# EAGLE design usb-100basefx (EAGLE 6.4)
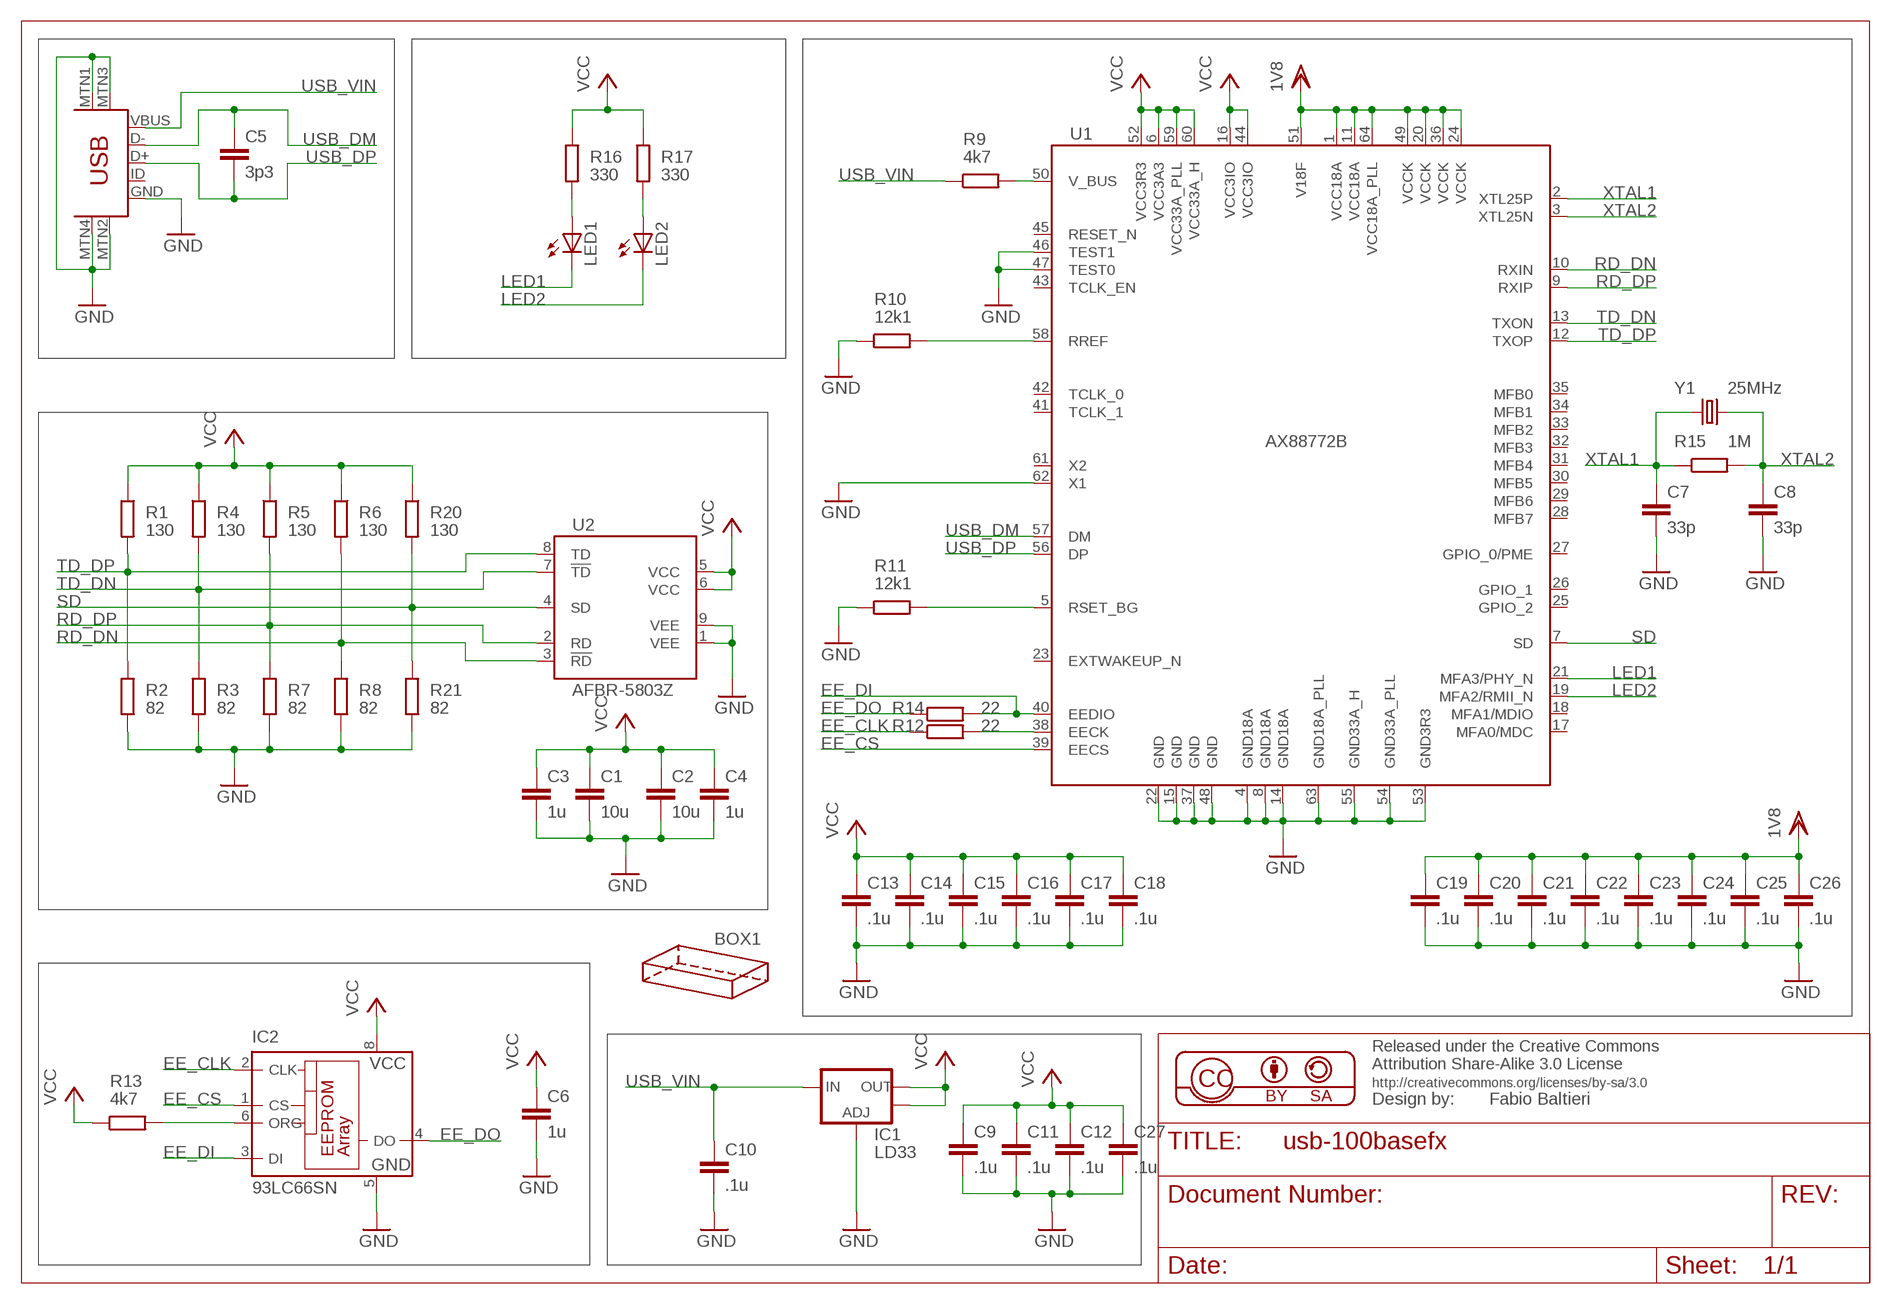
[diagram p0: schematic, sheet 1]

## Parts
BOX1  HAMMOND-BOX-R  [1551R]
C1  10u  C-EUC0603  [C0603]
C2  10u  C-EUC0603  [C0603]
C3  1u  C-EUC0603  [C0603]
C4  1u  C-EUC0603  [C0603]
C5  3p3  C-EUC0603  [C0603]
C6  1u  C-EUC0603  [C0603]
C7  33p  C-EUC0603  [C0603]
C8  33p  C-EUC0603  [C0603]
C9  .1u  C-EUC0603  [C0603]
C10  .1u  C-EUC0603  [C0603]
C11  .1u  C-EUC0603  [C0603]
C12  .1u  C-EUC0603  [C0603]
C13  .1u  C-EUC0603  [C0603]
C14  .1u  C-EUC0603  [C0603]
C15  .1u  C-EUC0603  [C0603]
C16  .1u  C-EUC0603  [C0603]
C17  .1u  C-EUC0603  [C0603]
C18  .1u  C-EUC0603  [C0603]
C19  .1u  C-EUC0603  [C0603]
C20  .1u  C-EUC0603  [C0603]
C21  .1u  C-EUC0603  [C0603]
C22  .1u  C-EUC0603  [C0603]
C23  .1u  C-EUC0603  [C0603]
C24  .1u  C-EUC0603  [C0603]
C25  .1u  C-EUC0603  [C0603]
C26  .1u  C-EUC0603  [C0603]
C27  .1u  C-EUC0603  [C0603]
IC1  LD33  V_REG_LM1117SOT223  [SOT223]
IC2  93LC66SN  [SO-08]
LED1  LEDCHIPLED_0805  [CHIPLED_0805]
LED2  LEDCHIPLED_0805  [CHIPLED_0805]
R1  130  R-EU_R0603  [R0603]
R2  82  R-EU_R0603  [R0603]
R3  82  R-EU_R0603  [R0603]
R4  130  R-EU_R0603  [R0603]
R5  130  R-EU_R0603  [R0603]
R6  130  R-EU_R0603  [R0603]
R7  82  R-EU_R0603  [R0603]
R8  82  R-EU_R0603  [R0603]
R9  4k7  R-EU_R0603  [R0603]
R10  12k1  R-EU_R0603  [R0603]
R11  12k1  R-EU_R0603  [R0603]
R12  22  R-EU_R0603  [R0603]
R13  4k7  R-EU_R0603  [R0603]
R14  22  R-EU_R0603  [R0603]
R15  1M  R-EU_R0603  [R0603]
R16  330  R-EU_R0603  [R0603]
R17  330  R-EU_R0603  [R0603]
R20  130  R-EU_R0603  [R0603]
R21  82  R-EU_R0603  [R0603]
U1  AX88772B  [LQFP64-0.4MM]
U2  AFBR-5803Z  [AFBR-5803Z]
U$1  USB-MINIB-5PIN  [USB-MINIB]
Y1  25MHz  CRYSTAL5X3  [CRYSTAL-SMD-5X3]

## Nets
EE_CLK: IC2.2(CLK) R12.1
EE_CS: IC2.1(CS) U1.39(EECS)
EE_DI: IC2.3(DI) R14.2 U1.40(EEDIO)
EE_DO: IC2.4(DO) R14.1
GND: C1.2 C2.2 C3.2 C4.2 C6.2 C7.2 C8.2 C9.2 C10.2 C11.2 C12.2 C13.2 C14.2 C15.2 C16.2 C17.2 C18.2 C19.2 C20.2 C21.2 C22.2 C23.2 C24.2 C25.2 C26.2 C27.2 IC1.1(ADJ) IC2.5(GND) R2.2 R3.2 R7.2 R8.2 R10.1 R11.1 R21.2 U1.4(GND18A) U1.8(GND18A) U1.14(GND18A) U1.15(GND) U1.22(GND) U1.37(GND) U1.46(TEST1) U1.47(TEST0) U1.48(GND) U1.53(GND3R3) U1.54(GND33A_PLL) U1.55(GND33A_H) U1.62(X1) U1.63(GND18A_PLL) U2.1(VEE) U2.9(VEE) U$1.GND U$1.MTN1(MTN2) U$1.MTN2(MTN3) U$1.MTN3(MTN1) U$1.MTN4
LED1: LED1.C U1.21(MFA3/PHY_N)
LED2: LED2.C U1.19(MFA2/RMII_N)
N$1: R9.2 U1.50(V_BUS)
N$2: R10.2 U1.58(RREF)
N$3: R11.2 U1.5(RSET_BG)
N$4: R12.2 U1.38(EECK)
N$5: IC2.6(ORG) R13.2
N$6: LED1.A R16.2
N$7: LED2.A R17.2
RD_DN: R6.2 R8.1 U1.10(RXIN) U2.3(!RD)
RD_DP: R5.2 R7.1 U1.9(RXIP) U2.2(RD)
SD: R20.2 R21.1 U1.7(SD) U2.4(SD)
TD_DN: R3.1 R4.2 U1.13(TXON) U2.7(!TD)
TD_DP: R1.2 R2.1 U1.12(TXOP) U2.8(TD)
USB_DM: C5.1 U1.57(DM) U$1.D-
USB_DP: C5.2 U1.56(DP) U$1.D+
USB_VIN: C10.1 IC1.3(IN) R9.1 U$1.VBUS
VCC: C1.1 C2.1 C3.1 C4.1 C6.1 C9.1 C11.1 C12.1 C13.1 C14.1 C15.1 C16.1 C17.1 C18.1 C27.1 IC1.2(OUT) IC1.4(OUT) IC2.8(VCC) R1.1 R4.1 R5.1 R6.1 R13.1 R16.1 R17.1 R20.1 U1.6(VCC3A3) U1.16(VCC3IO) U1.44(VCC3IO) U1.52(VCC3R3) U1.59(VCC33A_PLL) U1.60(VCC33A_H) U2.5(VCC) U2.6(VCC)
VDD: C19.1 C20.1 C21.1 C22.1 C23.1 C24.1 C25.1 C26.1 U1.1(VCC18A) U1.11(VCC18A) U1.20(VCCK) U1.24(VCCK) U1.36(VCCK) U1.49(VCCK) U1.51(V18F) U1.64(VCC18A_PLL) ; supply symbol labelled 1V8
XTAL1: C7.1 R15.1 U1.2(XTL25P) Y1.1
XTAL2: C8.1 R15.2 U1.3(XTL25N) Y1.3
Unconnected: IC2.7(NU) U1.17(MFA0/MDC) U1.18(MFA1/MDIO) U1.23(EXTWAKEUP_N) U1.25(GPIO_2) U1.26(GPIO_1) U1.27(GPIO_0/PME) U1.28(MFB7) U1.29(MFB6) U1.30(MFB5) U1.31(MFB4) U1.32(MFB3) U1.33(MFB2) U1.34(MFB1) U1.35(MFB0) U1.41(TCLK_1) U1.42(TCLK_0) U1.43(TCLK_EN) U1.45(RESET_N) U1.61(X2) U$1.ID

## Library data of the parts
BOX1 = hammond:HAMMOND-BOX: Hammond Project boxes Hammond 1551 Transluscent Blue 50x35x20mm 1551GTBU http://www.hammondmfg.com/pdf/1551G.pdf Hammond 1551 Transluscent Blue 50x50x20mm 1551RTBU http://www.hammondmfg.com/pdf/1551R.pdf Hammond 1551 Transluscent Blue 60x35x20mm 1551HTBU http://www.hammondmfg.com/pdf/1551H.pdf Hammond 1551 Transluscent Blue 80x40x20mm 1551KTBU http://www.hammondmfg.com/pdf/1551K.pdf Hammond 1591 Transluscent Blue 100x51x22m m 1591XXATBU http://www.hammondmfg.com/pdf/1591XXA.pdf
C1-C27 = rcl:C-EU: CAPACITOR, European symbol
IC1 = SparkFun-PowerIC:V_REG_LM1117: Voltage Regulator LM1117 Standard adjustable voltage regulator but in SMD form. Spark Fun Electronics SKU : COM-00595
IC2 = microchip:93*: Serial EPROM 1 K/2 K/4 K, low voltage, Microwire; MF: MICROCHIP; MPN: 93LC66/SN; OC_FARNELL: 1296586; OC_NEWARK: 65K1154
LED1 LED2 = led:LED: LED OSRAM: - CHIPLED LG R971, LG N971, LY N971, LG Q971, LY Q971, LO R971, LY R971 LH N974, LH R974 LS Q976, LO Q976, LY Q976 LO Q996 - Hyper CHIPLED LW Q18S LB Q993, LB Q99A, LB R99A - SideLED LS A670, LO A670, LY A670, LG A670, LP A670 LB A673, LV A673, LT A673, LW A673 LH A674 LY A675 LS A676, LA A676, LO A676, LY A676, LW A676 LS A679, LY A679, LG A679 - Hyper Micro SIDELED® LS Y876, LA Y876, LO Y876, LY Y876 LT Y87S - SmartLED LW L88C, LW L88S LB L89C, LB L89S, LG L890 LS L89K, LO L89K, LY L89K LS L896, LA L896, LO L896, LY L896 - TOPLED LS T670, LO T670, LY T670, LG T670, LP T670 LSG T670, LSP T670, LSY T670, LOP T670, LYG T670 LG T671, LOG T671, LSG T671 LB T673, LV T673, LT T673, LW T673 LH T674 LS T676, LA T676, LO T676, LY T676, LB T676, LH T676, LSB T676, LW T676 LB T67C, LV T67C, LT T67C, LS T67K, LO T67K, LY T67K, LW E67C LS E67B, LA E67B, LO E67B, LY E67B, LB E67C, LV E67C, LT E67C LW T67C LS T679, LY T679, LG T679 LS T770, LO T770, LY T770, LG T770, LP T770 LB T773, LV T773, LT T773, LW T773 LH T774 LS E675, LA E675, LY E675, LS T675 LS T776, LA T776, LO T776, LY T776, LB T776 LHGB T686 LT T68C, LB T68C - Hyper Mini TOPLED® LB M676 - Mini TOPLED Santana® LG M470 LS M47K, LO M47K, LY M47K Source: http://www.osram.convergy.de LUXEON: - LUMILED® LXK2-PW12-R00, LXK2-PW12-S00, LXK2-PW14-U00, LXK2-PW14-V00 LXK2-PM12-R00, LXK2-PM12-S00, LXK2-PM14-U00 LXK2-PE12-Q00, LXK2-PE12-R00, LXK2-PE12-S00, LXK2-PE14-T00, LXK2-PE14-U00 LXK2-PB12-K00, LXK2-PB12-L00, LXK2-PB12-M00, LXK2-PB14-N00, LXK2-PB14-P00, LXK2-PB14-Q00 LXK2-PR12-L00, LXK2-PR12-M00, LXK2-PR14-Q00, LXK2-PR14-R00 LXK2-PD12-Q00, LXK2-PD12-R00, LXK2-PD12-S00 LXK2-PH12-R00, LXK2-PH12-S00 LXK2-PL12-P00, LXK2-PL12-Q00, LXK2-PL12-R00 Source: www.luxeon.com KINGBRIGHT: KA-3528ASYC Source: www.kingbright.com
R1-R17 R20 R21 = rcl:R-EU_: RESISTOR, European symbol
U1 = balto:AX88772B: AX88772BLF / AX88772BLI Low-power
U2 = balto:AFBR-5803Z: AFBR-5803Z
U$1 = SparkFun-Connectors:USB-MINIB: Mini-USB "B" connector with 5th pin broken out. Created new symbol breaking out 5th "ID" pin in mini/micro USB connector spec. See: http://en.wikipedia.org/wiki/Mini_usb#Cables. Uses same footprint as 4-pin symbol. Also added pins to connect to mounting / shield pads if required (probably not generally needed as signals aren't shielded once they leave the connector).
Y1 = SparkFun-FreqCtrl:CRYSTAL: Various standard crystals. Proven footprints. Spark Fun Electronics SKU : COM-00534

## Board
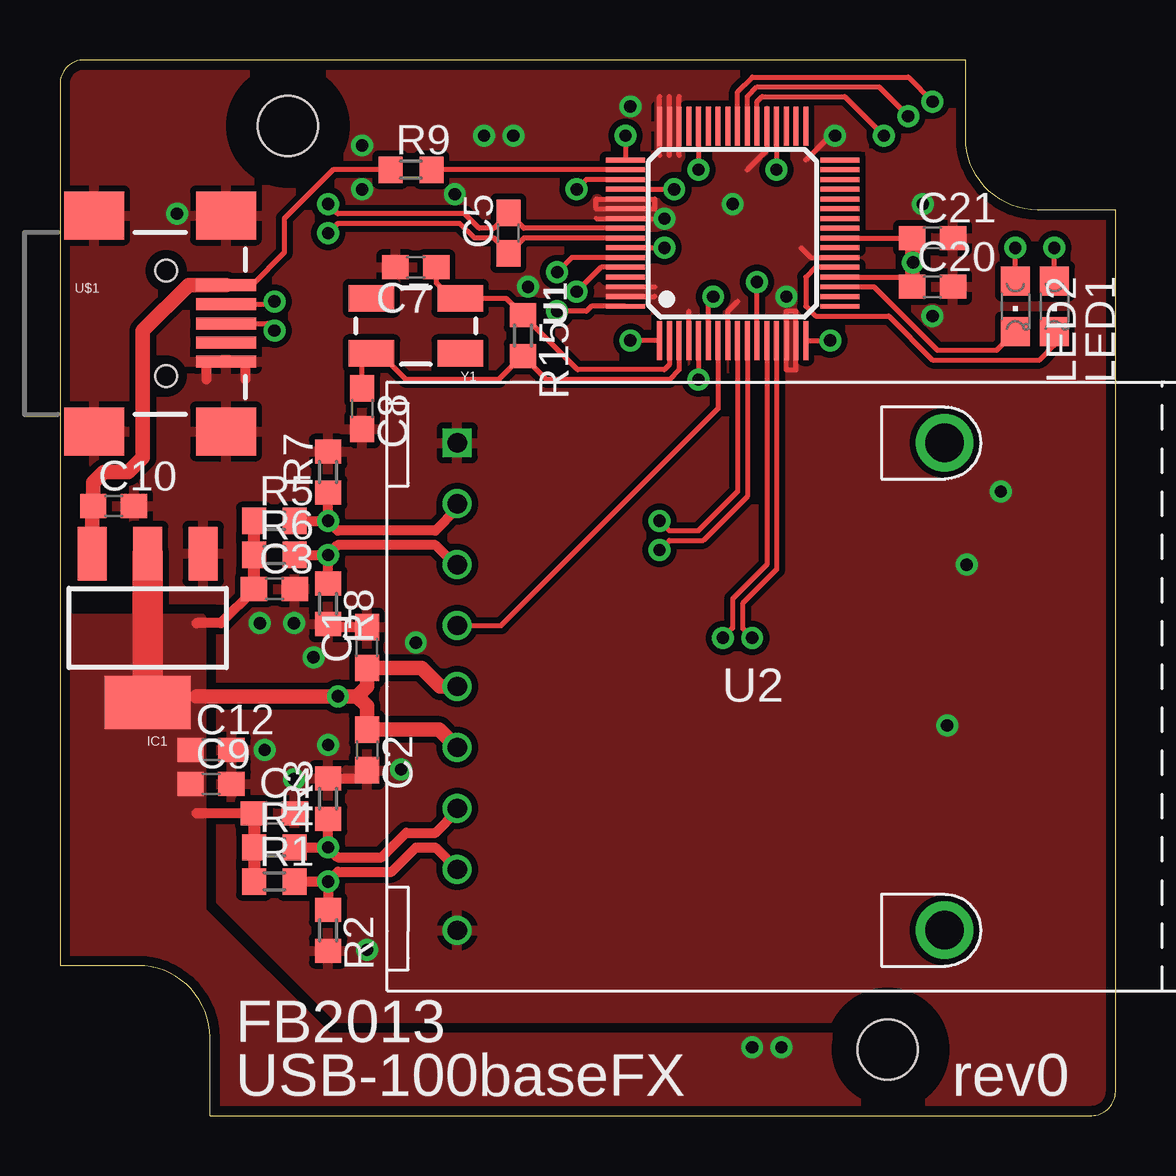
[diagram p1: board, top side]
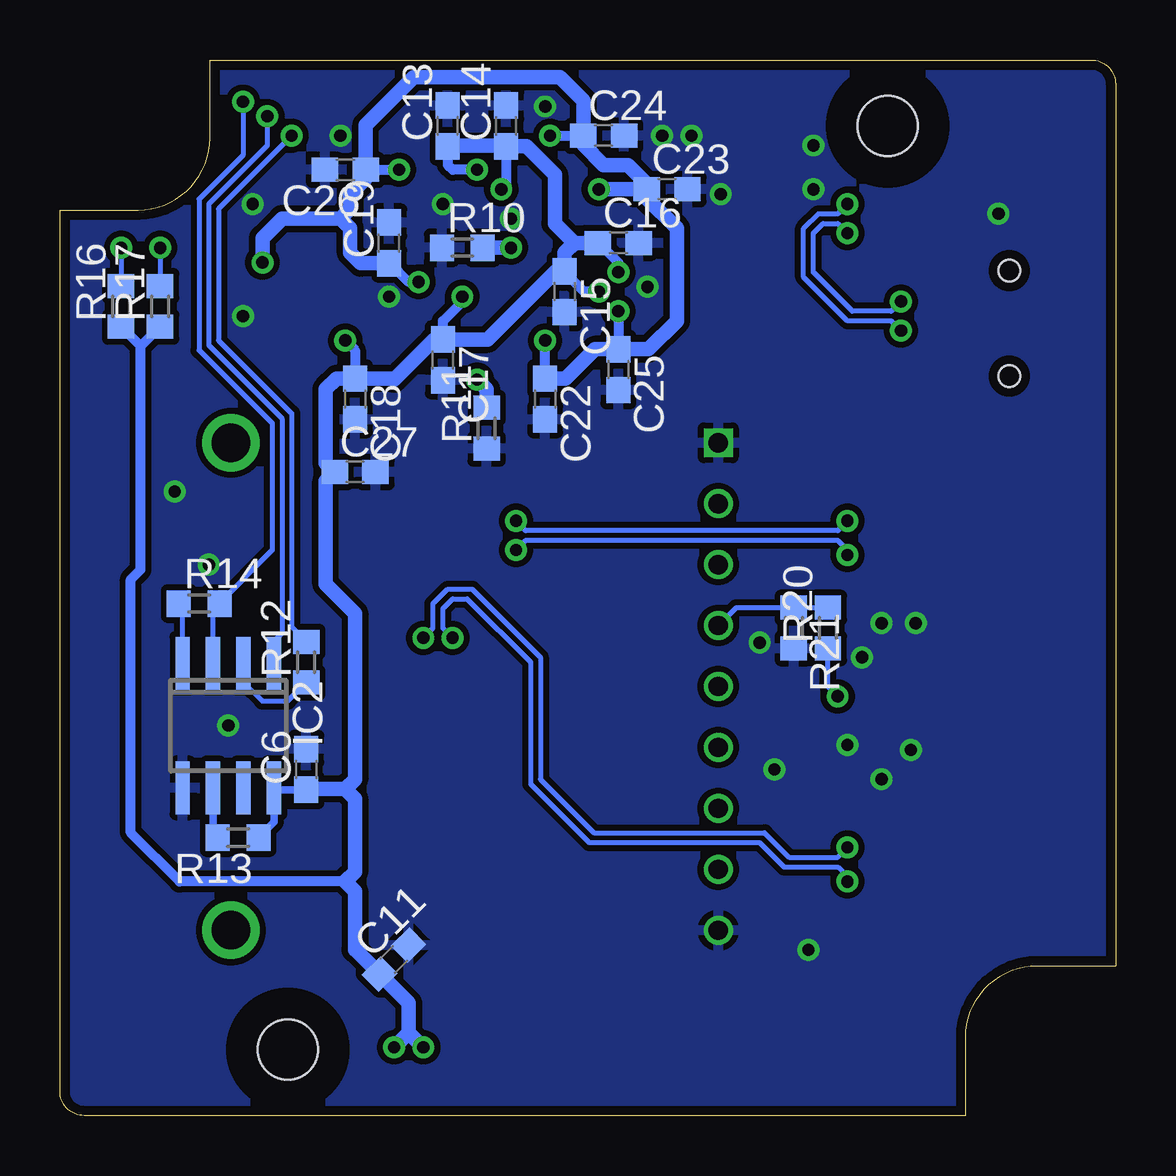
[diagram p2: board, bottom side, seen from below]

Size 44 x 44 mm. Coordinates in mm from the lower left corner, seen from the top.
Copper layers (1*16): Top 0.035mm / dielectric 1.5mm / Bottom 0.035mm
Design rules "cm *": minimum track width 8mil, minimum drill 20mil, track to track 8mil, track to pad 8mil, pad to pad 8mil, via to via 8mil, smd to smd 8mil, copper to edge 16mil, drill to drill 8mil, minimum pad ring 8mil, minimum via ring 8mil, stop-mask expansion 4mil, vias tented up to drill 20mil, thermal gap 10mil

### Footprints (pad centres in the part's own frame; a part is rotated, then mirrored left to right if it is on the bottom)
1551R = hole 2.5: 34.5,2.75; 9.5,41.25
C0603 = smd 1.1 x 1: 1 -0.85,0; 2 0.85,0
SOT223 = smd 1.219 x 2.235: 1 -2.311,-3.099; 2 0,-3.099; 3 2.311,-3.099 | smd 3.6 x 2.2: 4 0,3.099
SO-08 = smd 0.6 x 2.2: 1 -1.905,-2.6; 2 -0.635,-2.6; 3 0.635,-2.6; 4 1.905,-2.6; 5 1.905,2.6; 6 0.635,2.6; 7 -0.635,2.6; 8 -1.905,2.6
CHIPLED_0805 = smd 1.2 x 1.2: A 0,-1.05; C 0,1.05
R0603 = smd 1 x 1.1: 1 -0.85,0; 2 0.85,0
LQFP64-0.4MM = smd 0.203 x 1.626: 1 -3.048,-4.47; 2 -2.642,-4.47; 3 -2.235,-4.47; 4 -1.829,-4.47; 5 -1.422,-4.47; 6 -1.016,-4.47; 7 -0.61,-4.47; 8 -0.203,-4.47; 9 0.203,-4.47; 10 0.61,-4.47; 11 1.016,-4.47; 12 1.422,-4.47; 13 1.829,-4.47; 14 2.235,-4.47; 15 2.642,-4.47; 16 3.048,-4.47; 33 3.048,4.47; 34 2.642,4.47; 35 2.235,4.47; 36 1.829,4.47; 37 1.422,4.47; 38 1.016,4.47; 39 0.61,4.47; 40 0.203,4.47; 41 -0.203,4.47; 42 -0.61,4.47; 43 -1.016,4.47; 44 -1.422,4.47; 45 -1.829,4.47; 46 -2.235,4.47; 47 -2.642,4.47; 48 -3.048,4.47 | smd 1.626 x 0.203: 17 4.47,-3.048; 18 4.47,-2.642; 19 4.47,-2.235; 20 4.47,-1.829; 21 4.47,-1.422; 22 4.47,-1.016; 23 4.47,-0.61; 24 4.47,-0.203; 25 4.47,0.203; 26 4.47,0.61; 27 4.47,1.016; 28 4.47,1.422; 29 4.47,1.829; 30 4.47,2.235; 31 4.47,2.642; 32 4.47,3.048; 49 -4.47,3.048; 50 -4.47,2.642; 51 -4.47,2.235; 52 -4.47,1.829; 53 -4.47,1.422; 54 -4.47,1.016; 55 -4.47,0.61; 56 -4.47,0.203; 57 -4.47,-0.203; 58 -4.47,-0.61; 59 -4.47,-1.016; 60 -4.47,-1.422; 61 -4.47,-1.829; 62 -4.47,-2.235; 63 -4.47,-2.642; 64 -4.47,-3.048
AFBR-5803Z = drill 0.8 square: 1 -16.765,10.16 | drill 0.8: 2 -16.765,7.62; 3 -16.765,5.08; 4 -16.765,2.54; 5 -16.765,0; 6 -16.765,-2.54; 7 -16.765,-5.08; 8 -16.765,-7.62; 9 -16.765,-10.16 | drill 1.6: P$1 3.55,10.16; P$2 3.55,-10.16
USB-MINIB = smd 2.5 x 0.5: D+ 2.5,0; D- 2.5,0.8; GND 2.5,-1.6; ID 2.5,-0.8; VBUS 2.5,1.6 | smd 2.5 x 2: MTN1 -3,4.5; MTN2 2.5,4.5; MTN3 -3,-4.5; MTN4 2.5,-4.5 | hole 0.9: 0,2.2; 0,-2.2
CRYSTAL-SMD-5X3 = smd 1.9 x 1.1: 1 -1.85,-1.15; 2 1.85,-1.15; 3 1.85,1.15; 4 -1.85,1.15

### Placement (x,y rotation side)
BOX1  0,0 0 top
C1  12.8,19.51 90 top
C2  12.8,15.24 270 top
C3  8.94,21.95 0 top
C4  8.94,12.6 0 top
C5  18.69,36.78 90 top
C6  33.73,14.43 90 bottom
C7  14.83,35.36 180 top
C8  12.6,29.46 270 top
C9  6.3,13.82 0 top
C10  2.24,25.4 0 top
C11  30.07,6.5 45 bottom
C12  6.3,15.24 0 top
C13  27.84,41.25 90 bottom
C14  25.4,41.25 90 bottom
C15  22.96,34.34 270 bottom
C16  20.73,36.37 0 bottom
C17  28.04,31.5 270 bottom
C18  31.7,29.87 270 bottom
C19  30.28,36.37 90 bottom
C20  36.37,34.54 0 top
C21  36.37,36.58 0 top
C22  23.77,29.87 270 bottom
C23  18.69,38.61 0 bottom
C24  21.34,40.84 0 bottom
C25  20.73,31.09 270 bottom
C26  32.11,39.42 180 bottom
C27  31.7,26.82 0 bottom
IC1  3.66,20.32 180 top
IC2  36.98,16.26 180 bottom
LED1  41.45,33.73 180 top
LED2  39.83,33.73 180 top
R1  8.94,9.75 0 top
R2  11.18,7.72 270 top
R3  11.18,13.21 90 top
R4  8.94,11.18 0 top
R5  8.94,24.79 0 top
R6  8.94,23.37 0 top
R7  11.18,26.82 90 top
R8  11.18,21.34 270 top
R9  14.63,39.42 0 top
R10  27.23,36.17 0 bottom
R11  26.21,28.65 90 bottom
R12  33.73,18.9 90 bottom
R13  36.58,11.58 180 bottom
R14  38.2,21.34 0 bottom
R15  19.3,32.51 270 top
R16  41.45,33.73 90 bottom
R17  39.83,33.73 90 bottom
R20  11.99,20.32 90 bottom
R21  13.41,20.32 270 bottom
U1  28.04,36.78 0 top
U2  33.32,17.88 0 top
U$1  4.42,33.02 0 top
Y1  14.83,32.92 180 top

### Tracks (layer width: path | path; a pad name or v marks a point on that pad's centre or on a via)
EE_CLK
  Bottom 0.203: 36.35,19.74 IC2.2 36.35,18.06 35.56,17.27 34.51,17.27 R12.1
EE_CS  (via drill 0.51)
  Top 0.203: U1.39 28.65,42.47 29.06,42.88 34.14,42.88 v35.36,41.66
  Bottom 0.203: v35.36,41.66 35.36,40.44 37.8,38 37.8,32.11 34.75,29.06 34.75,20.12 35.08,19.79 IC2.1
EE_DI  (via drill 0.51)
  Top 0.203: U1.40 28.25,42.67 28.85,43.28 35.36,43.28 v36.37,42.27
  Bottom 0.203: v36.37,42.27 36.37,40.03 38.2,38.2 38.2,31.9 35.15,28.85 35.15,23.57 37.35,21.37 R14.2 37.62,21.07 IC2.3
EE_DO
  Bottom 0.203: IC2.4 38.89,21.17 R14.1
GND  (via drill 0.51)
  Top 0.203: U1.62 24.79,34.54 | U1.63 24.79,34.14 | 24.79,37.39 U1.55 22.35,37.39 | 24.99,40.03 U1.48 24.99,42.47 | 25.4,40.03 U1.47 25.4,42.47 | 25.81,40.03 U1.46 25.81,42.47 | U1.37 29.46,40.23 28.65,39.42 | U1.22 31.29,35.76 30.89,36.17 | U1.4 26.21,33.53 | U1.8 27.84,33.53 28.25,33.93 | v32.31,40.84 32.11,40.84 31.09,39.83 | U1.54 24.79,37.8 24.79,38.2 U1.53 22.35,38.2 22.35,37.8 U1.54 | U1.14 30.28,33.53 30.68,33.53 U1.15 30.68,31.09 30.28,31.09 U1.14
  Top 0.406: 7.72,30.68 7.72,31.42 U$1.GND 6.1,31.42 6.1,30.68 | R8.2 11.3,20.36 C1.2 | R3.2 12.47,14.06 C2.2
  Top 0.61: 12.67,14.26 C2.2 | 12.73,20.28 C1.2
  other vias: 4.88,37.59 12.8,6.91 28.04,38 19.51,34.54 35.97,38 36.37,33.32 37.8,22.96 39.22,26.01 30.28,34.14 36.98,16.26 23.77,42.06 18.9,40.84 17.68,40.84 12.6,40.44 12.6,38.61 16.46,38.4 9.75,14.02 8.53,15.24 9.75,20.52 8.33,20.52 11.18,15.44 10.57,19.1 14.22,14.43 14.83,19.71 25.2,37.39
  pour Top (isolate 0.254): 44.91,-0.61 44.91,45.11 -0.61,45.11 -0.61,21.54 6.71,21.54 6.71,8.94 11.58,4.06 34.54,4.06 34.54,-0.61
  pour Bottom (isolate 0.254): -0.2,-0.2 44.5,-0.2 44.5,44.7 -0.2,44.7
LED1
  Top 0.203: U1.21 31.5,35.36 31.09,34.95 31.09,33.73 31.5,33.33 34.54,33.33 36.37,31.5 40.84,31.5 41.45,32.11 LED1.C
LED2
  Top 0.203: U1.19 33.93,34.54 36.58,31.9 39.05,31.9 LED2.C
N$1
  Top 0.203: U1.50 R9.2
N$2  (via drill 0.51)
  Top 0.203: U1.58 v25.2,36.17
  Bottom 0.61: v25.2,36.17 R10.2
N$3  (via drill 0.51)
  Top 0.203: U1.5 v26.62,30.68
  Bottom 0.61: R11.2 26.21,30.28 v26.62,30.68
N$4  (via drill 0.51)
  Top 0.203: U1.38 29.06,42.27 29.26,42.47 32.72,42.47 v34.34,40.84
  Bottom 0.203: v34.34,40.84 37.39,37.8 37.39,32.31 34.34,29.26 34.34,20.36 R12.2
N$5
  Bottom 0.305: IC2.6 37.62,11.77 R13.2
N$6  (via drill 0.51)
  Top 0.203: LED1.A v41.45,36.17
  Bottom 0.203: v41.45,36.17 R16.2
N$7  (via drill 0.51)
  Top 0.203: LED2.A v39.83,36.17
  Bottom 0.203: v39.83,36.17 R17.2
RD_DN  (via drill 0.51)
  Top 0.203: U1.10 28.65,25.81 26.82,23.98 25.4,23.98 v24.99,23.57
  Top 0.406: v11.18,23.37 11.58,23.77 15.65,23.77 16.46,22.96 U2.3 | R6.2 v11.18,23.37 | R8.1 v11.18,23.37
  Bottom 0.203: v24.99,23.57 24.59,23.98 11.58,23.98 11.18,23.57 v11.18,23.37
RD_DP  (via drill 0.51)
  Top 0.203: U1.9 28.25,26.01 26.62,24.38 25.4,24.38 v24.99,24.79
  Top 0.406: v11.18,24.79 11.58,24.38 15.65,24.38 16.56,25.3 U2.2 | R5.2 v11.18,24.79 | v11.18,24.79 R7.1
  Bottom 0.203: v24.99,24.79 24.59,24.38 11.58,24.38 v11.18,24.79
SD
  Top 0.203: U1.7 27.43,29.46 18.39,20.42 U2.4
  Bottom 0.203: R20.2 R21.1 15.81,21.17 U2.4
TD_DN  (via drill 0.51)
  Top 0.203: U1.13 29.87,22.76 28.45,21.34 28.45,20.32 v28.85,19.91
  Top 0.406: R4.2 v11.18,11.18 | v11.18,11.18 11.58,10.77 13.41,10.77 14.43,11.79 15.65,11.79 16.56,12.7 U2.7 | v11.18,11.18 R3.1
  Bottom 0.203: v28.85,19.91 28.45,20.32 28.45,21.34 27.84,21.95 26.82,21.95 23.98,19.1 23.98,14.02 21.74,11.79 14.63,11.79 13.61,10.77 11.58,10.77 v11.18,11.18
TD_DP  (via drill 0.51)
  Top 0.203: U1.12 29.46,22.96 28.04,21.54 28.04,20.32 v27.64,19.91
  Top 0.406: R1.2 v11.18,9.75 | v11.18,9.75 11.58,10.16 13.82,10.16 14.83,11.18 15.65,11.18 U2.8 | v11.18,9.75 R2.1
  Bottom 0.203: v27.64,19.91 28.04,20.32 28.04,21.13 27.64,21.54 27.03,21.54 24.38,18.9 24.38,13.82 21.95,11.38 14.83,11.38 13.82,10.36 11.58,10.36 11.18,9.96 v11.18,9.75
USB_DM  (via drill 0.51)
  Top 0.203: U1.57 19.34,36.58 C5.1 18.69,35.97 18.09,36.58 17.27,36.58 16.66,37.19 11.58,37.19 v11.18,36.78 | U$1.D- 8.83,33.82 v8.94,33.93
  Bottom 0.203: v11.18,36.78 11.58,37.19 12.19,37.19 12.6,36.78 12.6,35.15 10.97,33.53 9.35,33.53 v8.94,33.93
USB_DP  (via drill 0.51)
  Top 0.203: U1.56 19.34,36.98 C5.2 18.69,37.59 18.09,36.98 17.48,36.98 16.87,37.59 11.58,37.59 v11.18,38 | U$1.D+ 8.64,33.02 v8.94,32.72
  Bottom 0.203: v8.94,32.72 9.35,33.12 11.18,33.12 13.01,34.95 13.01,36.98 12.39,37.59 11.58,37.59 v11.18,38
USB_VIN
  Top 0.203: R9.1 11.38,39.42 9.35,37.39 9.35,35.97 8,34.62 U$1.VBUS
  Top 0.61: IC1.3 1.35,25.36 C10.1 1.39,26.38 1.83,26.82 2.85,26.82 3.45,27.43 3.45,32.72 5.36,34.62 U$1.VBUS
VCC  (via drill 0.51)
  Top 0.203: U1.44 v26.62,39.42 | U1.6 27.03,33.93 v27.23,34.14 | U1.16 v32.11,32.31 | U1.52 v25.6,38.61 | v20.73,35.15 21.34,35.76 U1.59 | U1.60 22.55,35.36 v21.54,34.34
  Top 0.406: C3.1 8.09,21.91 6.71,20.52 5.69,20.52 | C4.1 5.69,12.6
  Top 0.508: C3.1 R6.1 R5.1 | R1.1 R4.1 C4.1 8.13,12.64
  Top 0.61: 12.39,17.48 12.8,17.07 C2.1 15.81,16.09 U2.6 | 12.39,17.48 12.8,17.88 C1.1 15.07,18.66 15.85,17.88 U2.5 | 12.39,17.48 v11.58,17.48 5.69,17.48
  Top 1.27: IC1.2 IC1.4
  Bottom 0.203: v11.58,17.48 11.99,17.88 R20.1
  Bottom 0.305: C6.1 35,13.58 IC2.8 35.08,12.23 R13.1
  Bottom 0.406: C14.1 25.4,38.81 v25.6,38.61 | C13.1 27.84,39.62 27.64,39.42 v26.62,39.42 | C16.1 21.54,36.37 20.73,35.56 v20.73,35.15 | C15.1 22.96,35.15 22.15,34.34 v21.54,34.34 | C17.1 28.04,33.12 27.23,33.93 v27.23,34.14 | 32.11,9.75 39.01,9.75 41.05,11.79 41.05,22.35 40.64,22.76 40.64,32.07 | 40.64,32.07 R17.1 | 40.64,32.07 R16.1 | v32.11,32.31 31.7,31.9 C18.1
  Bottom 0.61: C14.1 25.4,40.23 | C13.1 27.84,40.44 25.44,40.44 C14.1 | 22.55,36.37 23.37,37.19 23.37,39.22 24.55,40.4 C14.1 | 22.55,36.37 22.96,35.97 C15.1 23.33,35.19 26.18,32.35 C17.1 28.41,32.35 30.07,30.68 30.11,30.72 C18.1 32.48,30.72 32.92,30.28 32.92,27.19 C27.1 32.92,26.45 32.92,22.15 31.7,20.93 31.7,14.02 32.11,13.61 | C16.1 22.55,36.37 | 32.11,13.61 31.7,13.21 31.7,10.16 32.11,9.75 31.7,9.35 31.7,6.91 31.68,6.91 C11.1 29.46,4.69 29.46,3.45 | 29.46,3.45 v30.07,2.85 | 29.46,3.45 v28.85,2.85 | 32.11,13.61 33.69,13.61 C6.1
  pour Top (no thermals): -0.61,20.73 5.89,20.73 5.89,8.53 11.18,3.25 33.73,3.25 33.73,-0.61 -0.61,-0.61
VDD  (via drill 0.51)
  Top 0.203: U1.11 v29.06,34.75 | U1.36 v29.87,39.42 | U1.24 C21.1 | U1.20 35.12,34.95 C20.1 | U1.51 21.95,39.01 v21.54,38.61 | v23.57,40.84 U1.49 | U1.1 v23.77,32.31 | U1.64 22.15,33.73 21.95,33.53 v20.73,33.53
  Top 0.61: C21.1 35.52,35.6 v35.56,35.56 35.52,35.52 C20.1
  Bottom 0.406: v23.57,40.84 C24.1 | C26.1 v29.87,39.42 | C19.1 30.24,35.52 29.46,34.75 v29.06,34.75 | C22.1 v23.77,32.31 | v20.73,33.53 C25.1
  Bottom 0.61: C22.1 22.92,30.72 21.7,31.94 C25.1 19.47,31.94 18.29,33.12 18.29,36.98 19.54,38.24 C23.1 | v21.54,38.61 C23.1 | C23.1 19.54,38.85 20.32,39.62 21.34,39.62 22.19,40.47 C24.1 22.19,42.3 23.16,43.28 29.26,43.28 31.26,41.29 C26.1 31.26,39.05 31.9,38.41 31.9,37.8 32.31,37.39 | v35.56,35.56 35.56,36.58 34.75,37.39 32.31,37.39 | 32.31,37.39 31.9,36.98 31.9,35.97 31.46,35.52 C19.1
XTAL1
  Top 0.203: U1.2 25.4,31.29 25.2,31.09 21.58,31.09 R15.1 18.6,34.07 Y1.1 16.32,34.07 15.68,34.71 C7.1
XTAL2
  Top 0.203: U1.3 25.81,31.09 25.4,30.68 20.28,30.68 R15.2 19.27,31.66 18.29,30.68 14.43,30.68 13.34,31.77 Y1.3 12.6,31.38 C8.1

### Text on the board
_tsilk: FB2013 | USB-100baseFX | rev0